# EAGLE design bar graph meter 2in clip in w 47uF (EAGLE 7.4.0)
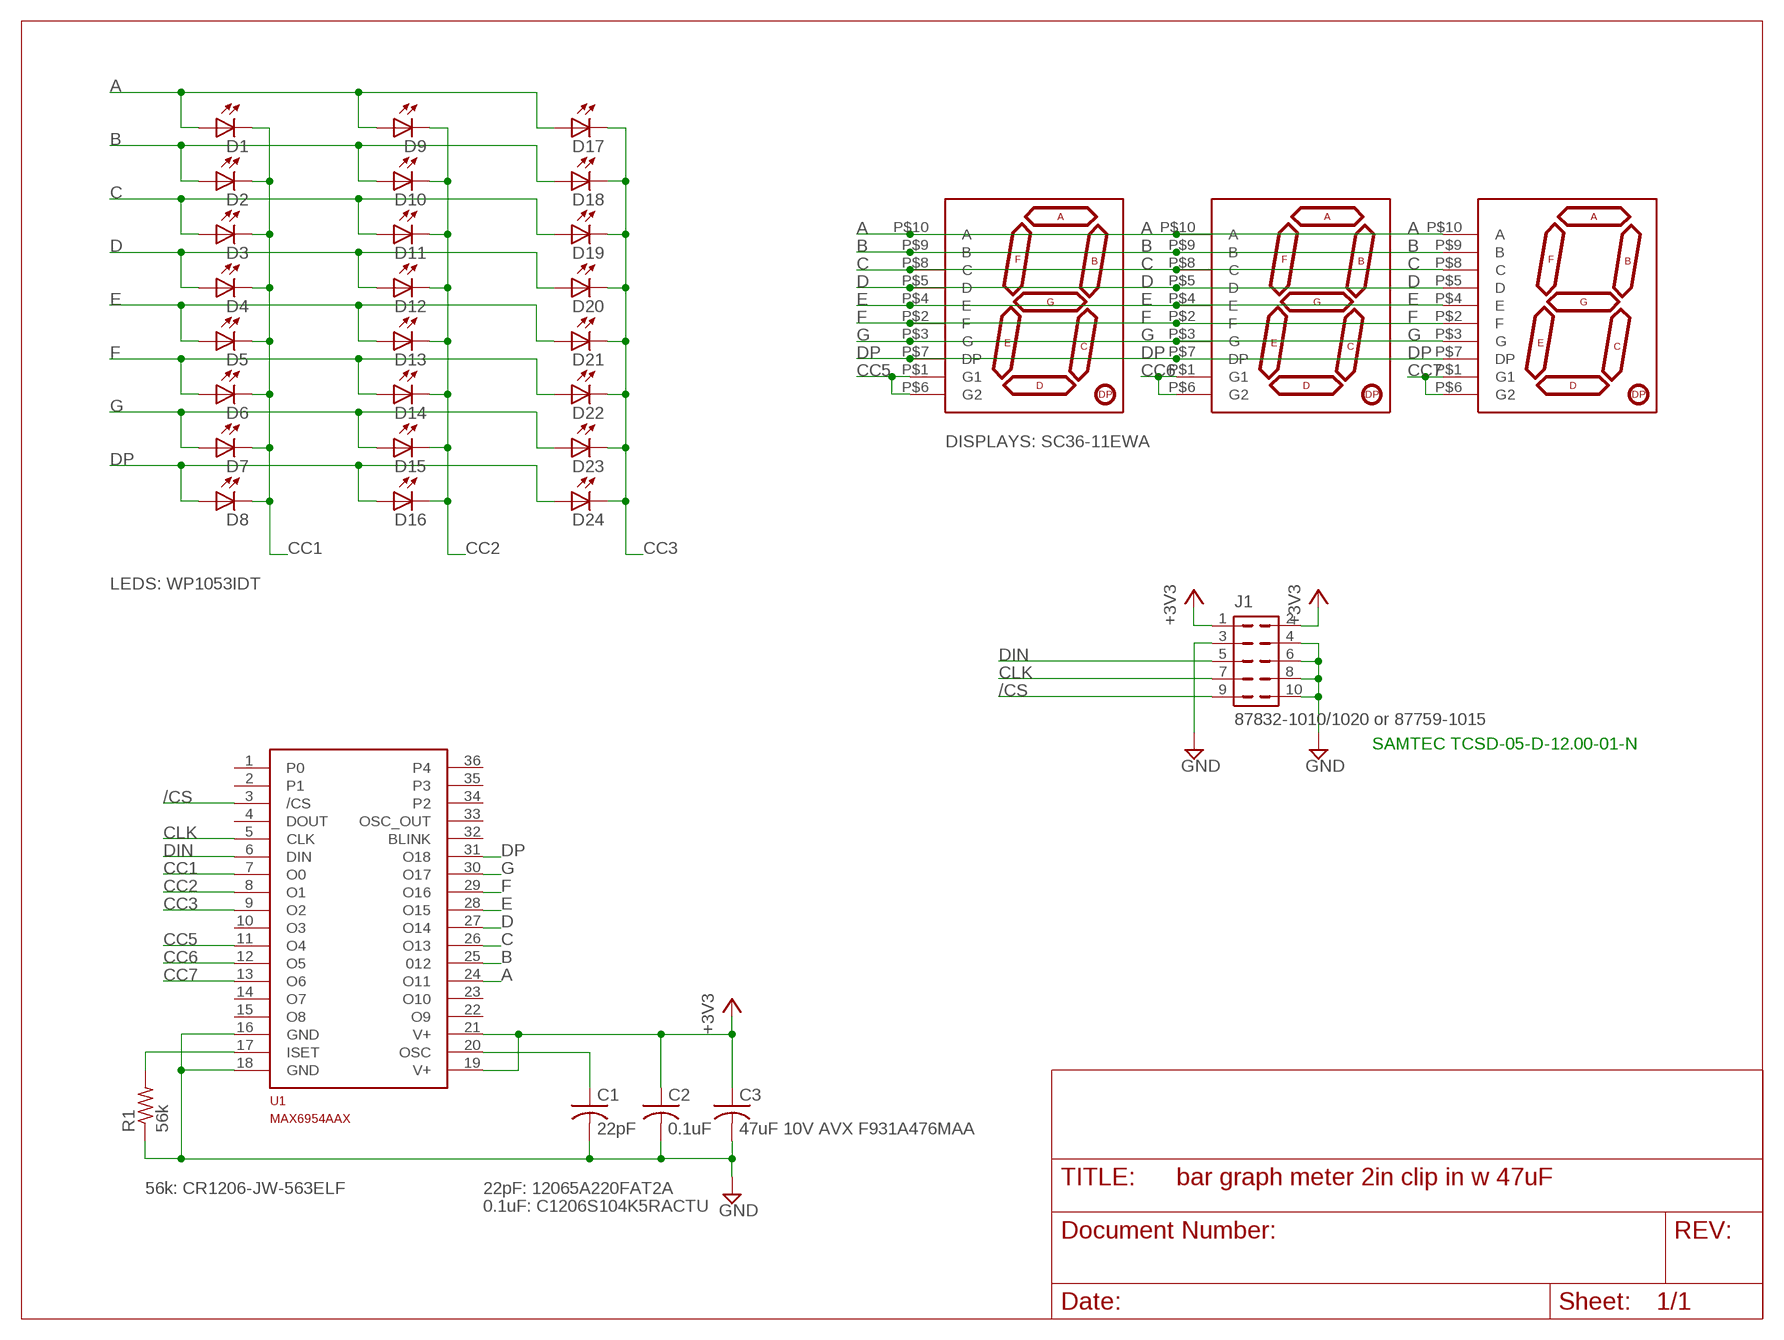
[diagram p0: schematic, sheet 1]

## Parts
C1  22pF  C-USC1206  [C1206]
C2  0.1uF  C-USC1206  [C1206]
C3  47uF 10V AVX F931A476MAA  C-USC1206  [C1206]
D1  LEDSQR2X5  [LED2X5]
D2  LEDSQR2X5  [LED2X5]
D3  LEDSQR2X5  [LED2X5]
D4  LEDSQR2X5  [LED2X5]
D5  LEDSQR2X5  [LED2X5]
D6  LEDSQR2X5  [LED2X5]
D7  LEDSQR2X5  [LED2X5]
D8  LEDSQR2X5  [LED2X5]
D9  LEDSQR2X5  [LED2X5]
D10  LEDSQR2X5  [LED2X5]
D11  LEDSQR2X5  [LED2X5]
D12  LEDSQR2X5  [LED2X5]
D13  LEDSQR2X5  [LED2X5]
D14  LEDSQR2X5  [LED2X5]
D15  LEDSQR2X5  [LED2X5]
D16  LEDSQR2X5  [LED2X5]
D17  LEDSQR2X5  [LED2X5]
D18  LEDSQR2X5  [LED2X5]
D19  LEDSQR2X5  [LED2X5]
D20  LEDSQR2X5  [LED2X5]
D21  LEDSQR2X5  [LED2X5]
D22  LEDSQR2X5  [LED2X5]
D23  LEDSQR2X5  [LED2X5]
D24  LEDSQR2X5  [LED2X5]
D25  SC36-11EWA  SA36-11EWA  [SA36-11]
D26  SC36-11EWA  SA36-11EWA  [SA36-11]
D27  SC36-11EWA  SA36-11EWA  [SA36-11]
J1  87832-1010/1020 or 87759-1015  87832-10  [87832-10]
R1  56k  R-US_R1206  [R1206]
U1  MAX6954AAX  [MAXIM-0.8-SSOP36]

## Nets
+3V3: C2.1 C3.1 J1.1 J1.2 U1.19(V+) U1.21(V+)
/CS: J1.9 U1.3(/CS)
A: D1.A D9.A D17.A D25.P$10(A) D26.P$10(A) D27.P$10(A) U1.24(O11)
B: D2.A D10.A D18.A D25.P$9(B) D26.P$9(B) D27.P$9(B) U1.25
C: D3.A D11.A D19.A D25.P$8(C) D26.P$8(C) D27.P$8(C) U1.26(O13)
CC1: D1.K(C) D2.K(C) D3.K(C) D4.K(C) D5.K(C) D6.K(C) D7.K(C) D8.K(C) U1.7(O0)
CC2: D9.K(C) D10.K(C) D11.K(C) D12.K(C) D13.K(C) D14.K(C) D15.K(C) D16.K(C) U1.8(O1)
CC3: D17.K(C) D18.K(C) D19.K(C) D20.K(C) D21.K(C) D22.K(C) D23.K(C) D24.K(C) U1.9(O2)
CC5: D25.P$1(G1) D25.P$6(G2) U1.11(O4)
CC6: D26.P$1(G1) D26.P$6(G2) U1.12(O5)
CC7: D27.P$1(G1) D27.P$6(G2) U1.13(O6)
CLK: J1.7 U1.5(CLK)
CSET: C1.1 U1.20(OSC)
D: D4.A D12.A D20.A D25.P$5(D) D26.P$5(D) D27.P$5(D) U1.27(O14)
DIN: J1.5 U1.6(DIN)
DP: D8.A D16.A D24.A D25.P$7(DP) D26.P$7(DP) D27.P$7(DP) U1.31(O18)
E: D5.A D13.A D21.A D25.P$4(E) D26.P$4(E) D27.P$4(E) U1.28(O15)
F: D6.A D14.A D22.A D25.P$2(F) D26.P$2(F) D27.P$2(F) U1.29(O16)
G: D7.A D15.A D23.A D25.P$3(G) D26.P$3(G) D27.P$3(G) U1.30(O17)
GND: C1.2 C2.2 C3.2 J1.3 J1.4 J1.6 J1.8 J1.10 R1.1 U1.16(GND) U1.18(GND)
ISET: R1.2 U1.17(ISET)
Unconnected: U1.1(P0) U1.2(P1) U1.4(DOUT) U1.10(O3) U1.14(O7) U1.15(O8) U1.22(O9) U1.23(O10) U1.32(BLINK) U1.33(OSC_OUT) U1.34(P2) U1.35(P3) U1.36(P4)

## Notes on the sheet
- DISPLAYS: SC36-11EWA
- LEDS: WP1053IDT
- SAMTEC TCSD-05-D-12.00-01-N
- 56k: CR1206-JW-563ELF | 22pF: 12065A220FAT2A
- 0.1uF: C1206S104K5RACTU

## Library data of the parts
C1-C3 = rcl:C-US: CAPACITOR, American symbol
D1-D24 = led:LED: LED OSRAM: - CHIPLED LG R971, LG N971, LY N971, LG Q971, LY Q971, LO R971, LY R971 LH N974, LH R974 LS Q976, LO Q976, LY Q976 LO Q996 - Hyper CHIPLED LW Q18S LB Q993, LB Q99A, LB R99A - SideLED LS A670, LO A670, LY A670, LG A670, LP A670 LB A673, LV A673, LT A673, LW A673 LH A674 LY A675 LS A676, LA A676, LO A676, LY A676, LW A676 LS A679, LY A679, LG A679 - Hyper Micro SIDELED® LS Y876, LA Y876, LO Y876, LY Y876 LT Y87S - SmartLED LW L88C, LW L88S LB L89C, LB L89S, LG L890 LS L89K, LO L89K, LY L89K LS L896, LA L896, LO L896, LY L896 - TOPLED LS T670, LO T670, LY T670, LG T670, LP T670 LSG T670, LSP T670, LSY T670, LOP T670, LYG T670 LG T671, LOG T671, LSG T671 LB T673, LV T673, LT T673, LW T673 LH T674 LS T676, LA T676, LO T676, LY T676, LB T676, LH T676, LSB T676, LW T676 LB T67C, LV T67C, LT T67C, LS T67K, LO T67K, LY T67K, LW E67C LS E67B, LA E67B, LO E67B, LY E67B, LB E67C, LV E67C, LT E67C LW T67C LS T679, LY T679, LG T679 LS T770, LO T770, LY T770, LG T770, LP T770 LB T773, LV T773, LT T773, LW T773 LH T774 LS E675, LA E675, LY E675, LS T675 LS T776, LA T776, LO T776, LY T776, LB T776 LHGB T686 LT T68C, LB T68C - Hyper Mini TOPLED® LB M676 - Mini TOPLED Santana® LG M470 LS M47K, LO M47K, LY M47K Source: http://www.osram.convergy.de LUXEON: - LUMILED® LXK2-PW12-R00, LXK2-PW12-S00, LXK2-PW14-U00, LXK2-PW14-V00 LXK2-PM12-R00, LXK2-PM12-S00, LXK2-PM14-U00 LXK2-PE12-Q00, LXK2-PE12-R00, LXK2-PE12-S00, LXK2-PE14-T00, LXK2-PE14-U00 LXK2-PB12-K00, LXK2-PB12-L00, LXK2-PB12-M00, LXK2-PB14-N00, LXK2-PB14-P00, LXK2-PB14-Q00 LXK2-PR12-L00, LXK2-PR12-M00, LXK2-PR14-Q00, LXK2-PR14-R00 LXK2-PD12-Q00, LXK2-PD12-R00, LXK2-PD12-S00 LXK2-PH12-R00, LXK2-PH12-S00 LXK2-PL12-P00, LXK2-PL12-Q00, LXK2-PL12-R00 Source: www.luxeon.com KINGBRIGHT: KA-3528ASYC Source: www.kingbright.com
D25-D27 = GlenPartsLibrary:SA36-11EWA
J1 = con-molex:87832-10: Milli-Grid Header 2.00mm (.079") Pitch; OC_FARNELL: unknown; OC_NEWARK: unknown
R1 = rcl:R-US_: RESISTOR, American symbol
U1 = GlenPartsLibrary:MAX6954AAX

## Board
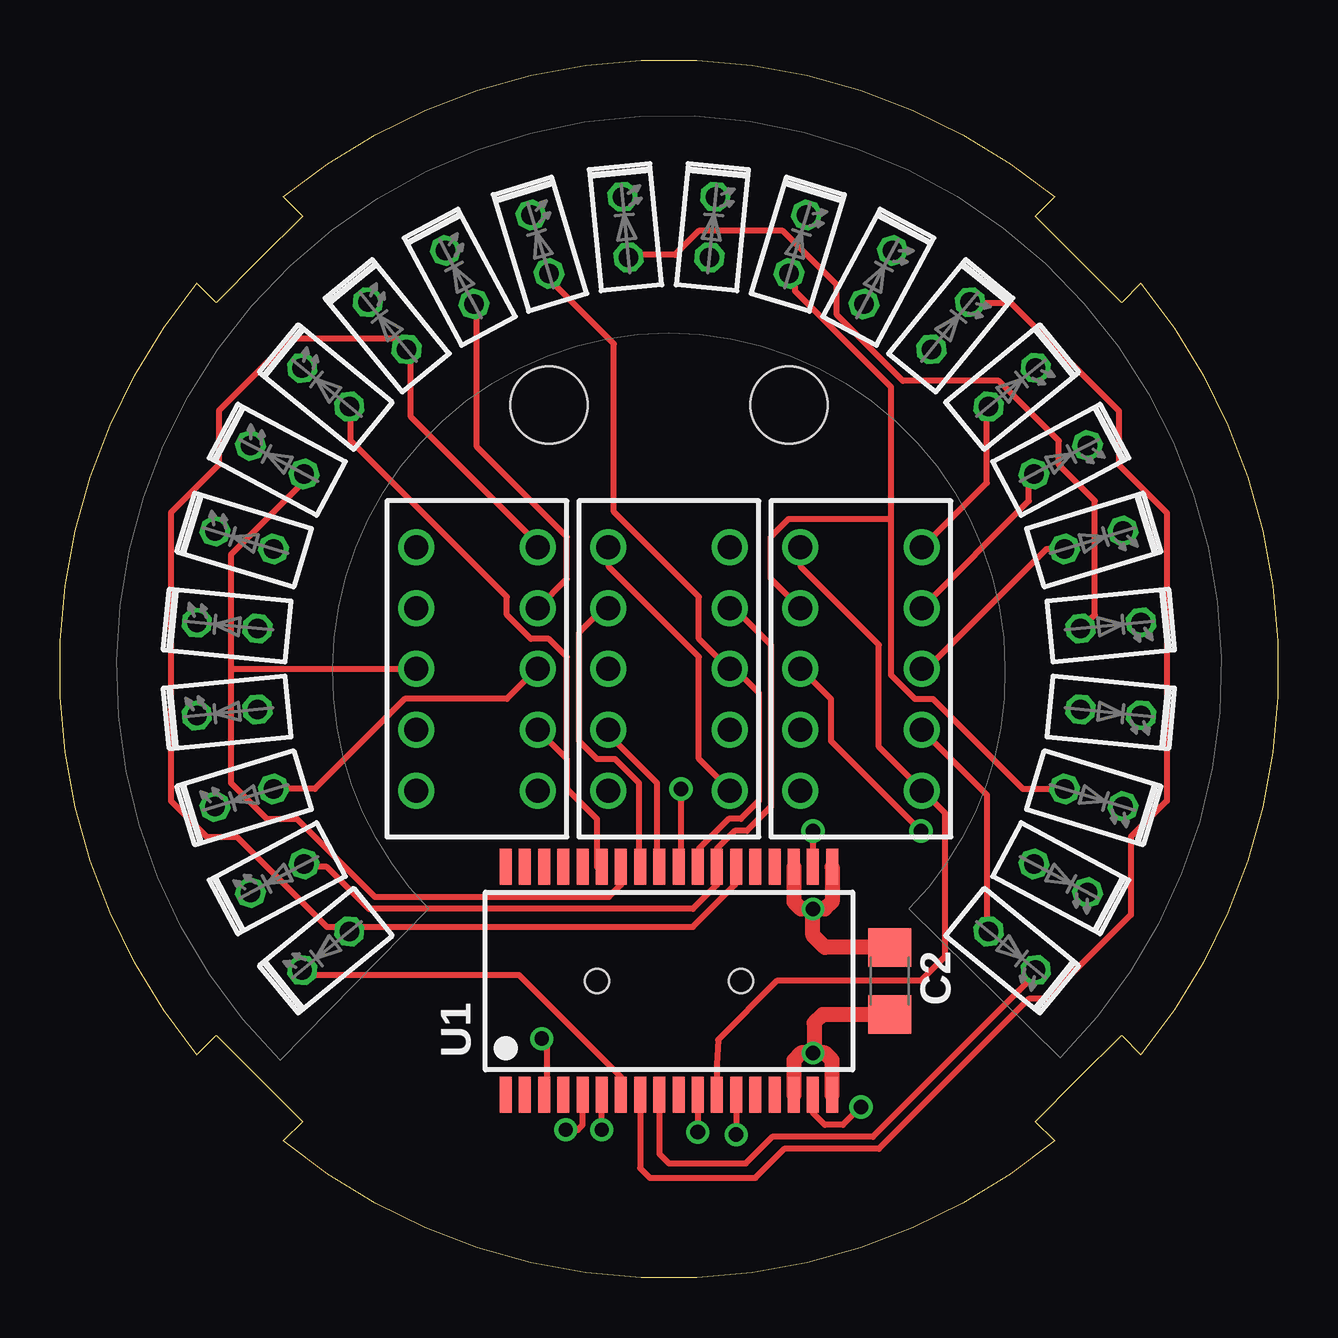
[diagram p1: board, top side]
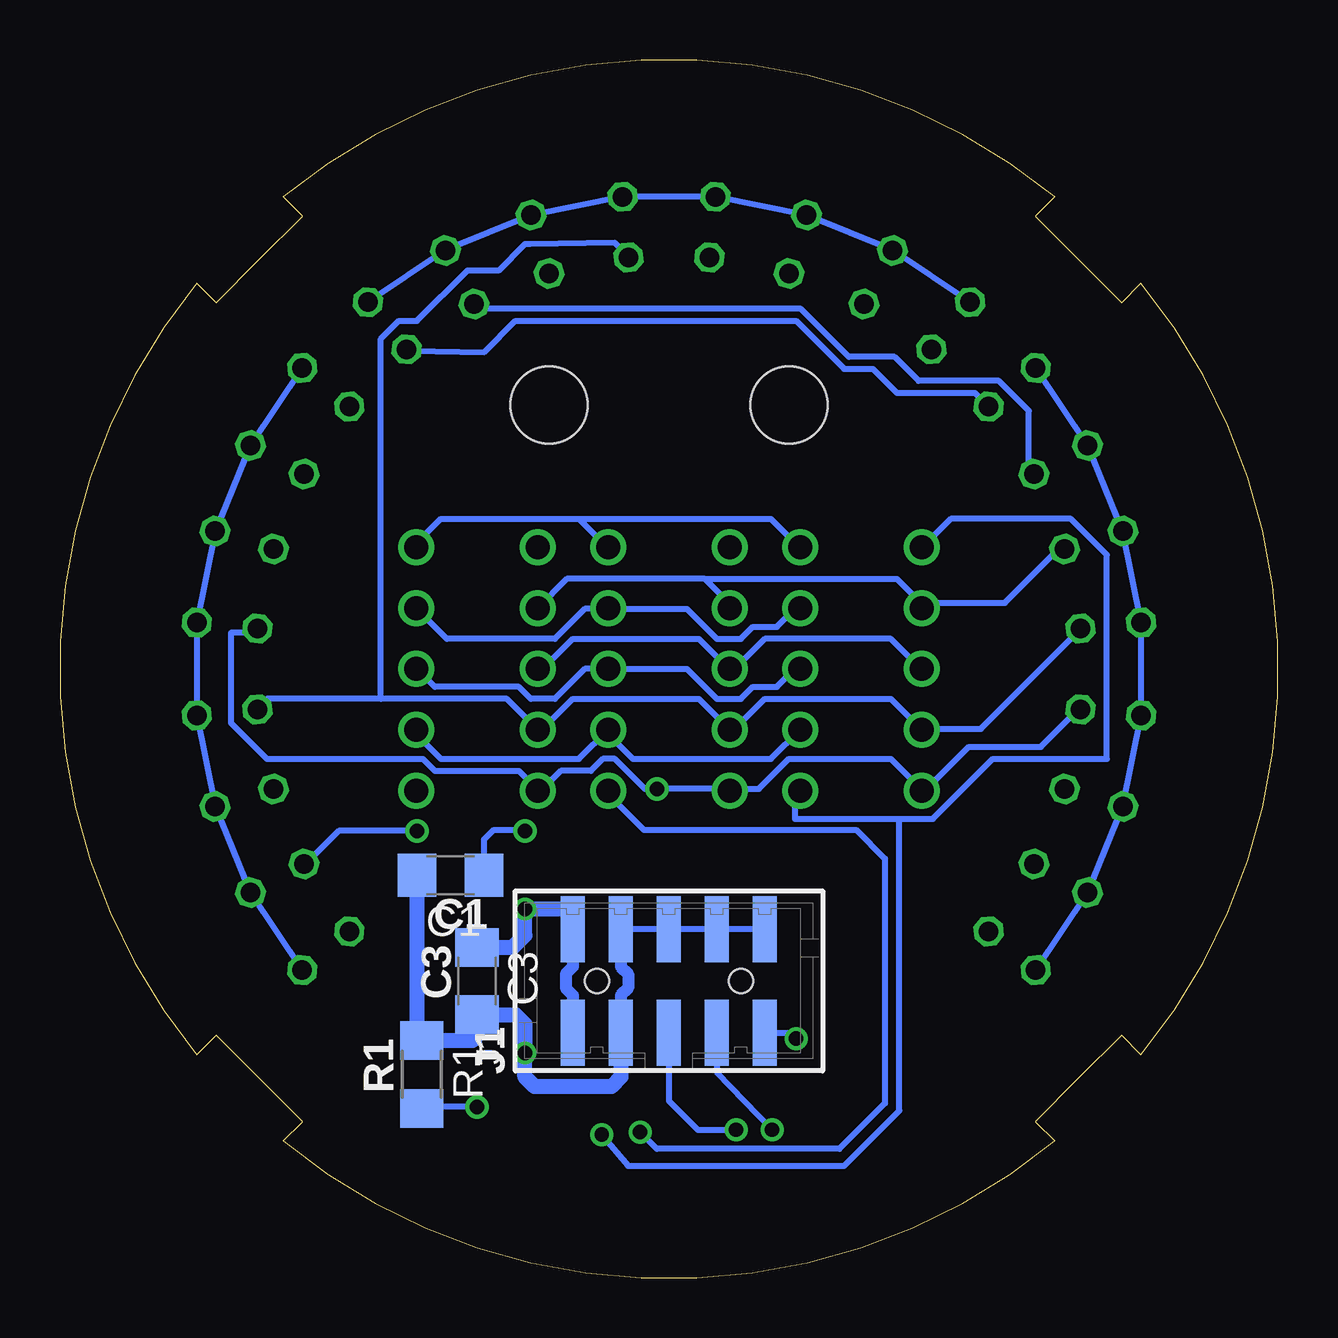
[diagram p2: board, bottom side, seen from below]

Size 50.75 x 50.75 mm. Coordinates in mm from the lower left corner, seen from the top.
Outline: 5.71,9.3 arc-79 5.71,41.45 6.51,40.64 8.31,42.44 10.11,44.23 9.3,45.04 arc-79 41.45,45.04 40.64,44.23 42.44,42.44 44.23,40.64 45.04,41.45 arc-79 45.04,9.3 44.23,10.11 42.44,8.31 40.64,6.51 41.45,5.71 arc-79 9.3,5.71 10.11,6.51 8.31,8.31 6.51,10.11 5.71,9.3
Copper layers (1*16): Top 0.0356mm / dielectric 1.5011mm / Bottom 0.0356mm
Design rules "LaenPCBOrder": minimum track width 6mil, minimum drill 13mil, track to track 6mil, track to pad 6mil, pad to pad 6mil, via to via 6mil, smd to smd 6mil, copper to edge 15mil, drill to drill 6mil, minimum pad ring 7mil, minimum via ring 7mil, stop-mask expansion 4mil, vias tented up to drill 0mil, thermal gap 10mil
Holes 3.2 mm at 30.37,36.37 20.37,36.37
tKeepout: area 6.5,38.8 to 11.9,44.2; area 6.5,6.5 to 11.9,11.9; area 38.8,38.8 to 44.2,44.2; area 38.8,6.5 to 44.2,11.9
bKeepout: area 6.5,38.8 to 11.9,44.2; area 38.8,38.8 to 44.2,44.2; area 38.8,6.5 to 44.2,11.9; area 6.5,6.5 to 11.9,11.9

### Footprints (pad centres in the part's own frame; a part is rotated, then mirrored left to right if it is on the bottom)
C1206 = smd 1.6 x 1.8: 1 -1.4,0; 2 1.4,0
LED2X5 = drill 0.813 octagon: A -1.27,0; K 1.27,0
SA36-11 = drill 1: P$1 -2.54,5.08; P$2 -2.54,2.54; P$3 -2.54,0; P$4 -2.54,-2.54; P$5 -2.54,-5.08; P$6 2.54,-5.08; P$7 2.54,-2.54; P$8 2.54,0; P$9 2.54,2.54; P$10 2.54,5.08
87832-10 = smd 1 x 2.75: 1 -4,-2.15; 2 -4,2.15; 3 -2,-2.15; 4 -2,2.15; 5 0,-2.15; 6 0,2.15; 7 2,-2.15; 8 2,2.15; 9 4,-2.15; 10 4,2.15 | hole 1: -3,0; 3,0
R1206 = smd 1.6 x 1.803: 1 -1.422,0; 2 1.422,0
MAXIM-0.8-SSOP36 = smd 0.5 x 1.5: 1 -6.8,-4.75; 2 -6,-4.75; 3 -5.2,-4.75; 4 -4.4,-4.75; 5 -3.6,-4.75; 6 -2.8,-4.75; 7 -2,-4.75; 8 -1.2,-4.75; 9 -0.4,-4.75; 10 0.4,-4.75; 11 1.2,-4.75; 12 2,-4.75; 13 2.8,-4.75; 14 3.6,-4.75; 15 4.4,-4.75; 16 5.2,-4.75; 17 6,-4.75; 18 6.8,-4.75; 19 6.8,4.75; 20 6,4.75; 21 5.2,4.75; 22 4.4,4.75; 23 3.6,4.75; 24 2.8,4.75; 25 2,4.75; 26 1.2,4.75; 27 0.4,4.75; 28 -0.4,4.75; 29 -1.2,4.75; 30 -2,4.75; 31 -2.8,4.75; 32 -3.6,4.75; 33 -4.4,4.75; 34 -5.2,4.75; 35 -6,4.75; 36 -6.8,4.75

### Placement (x,y rotation side)
C1  34.47,16.77 180 bottom
C2  34.57,12.37 270 top
C3  33.37,12.37 270 bottom
D1  11.07,13.63 219.4 top
D2  9.05,16.65 208.1 top
D3  7.67,20 196.9 top
D4  6.96,23.56 185.6 top
D5  6.96,27.18 174.4 top
D6  7.67,30.74 163.1 top
D7  9.05,34.09 151.9 top
D8  11.07,37.11 140.6 top
D9  13.63,39.67 129.4 top
D10  16.65,41.69 118.1 top
D11  20,43.07 106.9 top
D12  23.56,43.78 95.6 top
D13  27.18,43.78 84.4 top
D14  30.74,43.07 73.1 top
D15  34.09,41.69 61.9 top
D16  37.11,39.67 50.6 top
D17  39.67,37.11 39.4 top
D18  41.69,34.09 28.1 top
D19  43.07,30.74 16.9 top
D20  43.78,27.18 5.6 top
D21  43.78,23.56 354.4 top
D22  43.07,20 343.1 top
D23  41.69,16.65 331.9 top
D24  39.67,13.63 320.6 top
D25  25.37,25.37 0 top
D26  33.37,25.37 0 top
D27  17.37,25.37 0 top
J1  25.37,12.37 0 bottom
R1  35.67,8.47 270 bottom
U1  25.37,12.37 0 top

### Tracks (layer width: path | path; a pad name or v marks a point on that pad's centre or on a via)
+3V3  (via drill 0.6)
  Top 0.635: U1.19 32.17,15.67 31.87,15.37 v31.37,15.37 | U1.21 30.57,15.67 30.87,15.37 v31.37,15.37 | C2.1 31.87,13.77 31.37,14.27 v31.37,15.37
  Bottom 0.508: J1.2 29.37,12.97 29.67,12.67 29.67,12.07 29.37,11.77 J1.1
  Bottom 0.635: 29.47,14.47 J1.2 29.37,15.27 29.47,15.37 v31.37,15.37 31.37,14.27 31.87,13.77 C3.1
/CS  (via drill 0.6)
  Top 0.254: v20.07,9.97 20.27,9.77 20.27,7.72 U1.3
  Bottom 0.254: J1.9 20.32,10.22 v20.07,9.97
A
  Top 0.254: U1.24 28.12,17.12 28.12,16.37 26.37,14.62 12.12,14.62 D1.A 11.87,14.62 11.12,14.62 7.37,18.37 6.12,18.37 4.62,19.87 4.62,31.87 6.62,33.87 6.62,36.12 9.62,39.12 14.12,39.12 14.37,38.87 D9.A 14.62,38.62 14.62,35.87 19.87,30.62 D27.P$10 | D17.A 38.62,36.12 38.62,33.12 36.12,30.62 D26.P$10
  Bottom 0.254: 29.12,31.62 28.12,30.62 D25.P$10 | 29.12,31.62 34.87,31.62 35.87,30.62 D26.P$10 | 29.12,31.62 21.12,31.62 20.12,30.62 D27.P$10
B
  Top 0.254: D27.P$9 21.12,29.12 21.12,30.87 17.37,34.62 17.37,40.37 D10.A | D26.P$9 40.37,32.37 40.37,33.37 D18.A | D25.P$9 28.12,27.87 29.62,26.37 29.62,19.62 28.62,18.62 28.12,18.62 27.37,17.87 U1.25 27.37,16.37 26.37,15.37 12.87,15.37 11.12,17.12 10.37,17.12 D2.A
  Bottom 0.254: D26.P$9 34.62,26.62 30.12,26.62 28.87,27.87 28.12,27.87 D25.P$9 27.87,27.87 24.62,27.87 23.37,26.62 22.37,26.62 21.87,27.12 20.87,27.12 20.12,27.87 D27.P$9
C
  Top 0.254: D3.A 9.12,20.37 10.62,20.37 14.37,24.12 18.62,24.12 19.87,25.37 D27.P$8 | D19.A 41.62,30.37 41.12,30.37 36.12,25.37 D26.P$8 | U1.26 26.62,17.12 26.62,17.87 27.87,19.12 28.37,19.12 29.12,19.87 29.12,24.37 28.12,25.37 D25.P$8 27.87,25.37 26.62,26.62 26.62,28.37 23.07,31.92 23.07,38.92 20.37,41.62 D11.A
  Bottom 0.254: D26.P$8 35.87,25.37 35.12,24.62 31.62,24.62 31.12,24.12 30.12,24.12 28.87,25.37 D25.P$8 24.62,25.37 23.37,24.12 22.37,24.12 21.87,24.62 20.87,24.62 20.12,25.37 D27.P$8
CC1
  Top 0.254: D1.K 10.12,12.62 19.12,12.62 23.37,8.37 U1.7
  Bottom 0.254: D1.K D2.K D3.K D4.K D5.K D6.K D7.K D8.K
CC2
  Top 0.254: D16.K 38.12,40.62 39.62,40.62 44.12,36.12 44.12,33.87 46.12,31.87 46.12,19.87 44.62,18.37 44.62,15.12 41.12,11.62 40.37,11.62 34.12,5.37 30.17,5.37 28.97,4.17 24.57,4.17 24.17,4.57 U1.8
  Bottom 0.254: D9.K D10.K D11.K D12.K D13.K D14.K D15.K D16.K
CC3
  Top 0.254: D24.K 40.62,12.62 33.87,5.87 29.67,5.87 28.57,4.77 25.37,4.77 24.97,5.17 U1.9
  Bottom 0.254: D17.K D18.K D19.K D20.K D21.K D22.K D23.K D24.K
CC5  (via drill 0.61)
  Top 0.254: D25.P$1 22.87,30.37 22.87,29.62 26.62,25.87 26.62,21.62 27.87,20.37 D25.P$6 | U1.11 v26.57,6.07
  Bottom 0.254: v26.57,6.07 25.87,5.37 18.27,5.37 16.37,7.27 16.37,17.47 17.57,18.67 26.42,18.67 27.87,20.12 D25.P$6
CC6
  Top 0.254: U1.12 27.37,8.87 27.42,9.92 29.87,12.37 35.87,12.37 36.87,13.37 36.87,19.37 36.12,20.12 D26.P$6 35.87,20.37 34.12,22.12 34.12,26.37 30.87,29.62 30.87,30.37 D26.P$1
CC7  (via drill 0.6)
  Top 0.254: U1.13 v28.17,5.97
  Bottom 0.254: D27.P$6 20.12,20.12 20.12,19.12 15.77,19.12 | 15.77,19.12 14.37,19.12 11.87,21.62 7.12,21.62 7.12,30.12 8.62,31.62 13.62,31.62 14.62,30.62 D27.P$1 | v28.17,5.97 27.07,4.67 18.07,4.67 15.77,6.97 15.77,19.12
CLK  (via drill 0.6)
  Top 0.254: v21.07,6.17 21.57,6.17 21.77,6.37 U1.5
  Bottom 0.254: J1.7 23.37,8.57 v21.07,6.17
CSET  (via drill 0.61)
  Top 0.254: v31.37,18.62 U1.20
  Bottom 0.254: C1.1 33.07,18.27 32.67,18.67 31.42,18.67 v31.37,18.62
D  (via drill 0.61)
  Top 0.254: v25.87,20.37 25.87,17.12 U1.27 | D12.A 23.87,42.62 25.62,42.62 26.62,43.62 30.12,43.62 32.37,41.37 32.37,40.12 35.12,37.37 39.12,37.37 41.62,34.87 41.62,33.87 43.12,32.37 43.12,27.62 42.62,27.12 D20.A
  Bottom 0.254: D4.A 8.37,23.62 9.87,22.12 12.87,22.12 14.62,20.37 D27.P$5 14.87,20.37 16.12,21.62 20.37,21.62 21.62,20.37 22.62,20.37 D25.P$5 22.87,20.37 v25.87,20.37 26.37,20.37 27.62,21.62 28.12,21.62 28.62,21.12 29.87,21.12 30.62,20.37 D26.P$5 30.87,20.37 31.62,21.12 35.12,21.12 35.62,21.62 42.12,21.62 43.62,23.12 43.62,26.87 42.62,26.87 D20.A
DIN  (via drill 0.6)
  Top 0.254: v22.57,6.17 U1.6
  Bottom 0.254: J1.5 25.37,7.37 24.17,6.17 v22.57,6.17
DP
  Top 0.254: 21.12,21.62 21.12,20.37 22.37,19.12 22.37,17.12 U1.31 | D27.P$7 21.12,21.62 | D26.P$7 38.62,20.12 38.62,14.62 D24.A | 21.12,21.62 21.12,25.87 20.37,26.62 19.62,26.62 18.62,27.62 18.62,28.37 12.12,34.87 12.12,36.12 D8.A
  Bottom 0.254: D8.A 12.12,36.37 12.62,36.87 15.87,36.87 16.87,37.87 18.07,37.87 20.07,39.87 31.77,39.87 33.07,38.57 36.12,38.62 D16.A | D26.P$7 35.87,22.62 34.87,21.62 29.12,21.62 D25.P$7 27.87,22.62 26.87,21.62 21.12,21.62 D27.P$7
E
  Top 0.254: U1.28 24.87,17.12 24.87,20.62 22.87,22.62 D25.P$4
  Bottom 0.254: D5.A 8.37,26.87 12.37,22.87 14.62,22.87 D27.P$4 16.12,24.12 21.37,24.12 22.62,22.87 D25.P$4 24.12,24.12 29.37,24.12 30.62,22.87 D26.P$4 32.12,24.12 37.37,24.12 | 37.37,24.12 42.12,24.12 42.37,23.87 D21.A | 37.37,24.12 37.37,39.12 36.62,39.87 35.87,39.87 33.77,41.97 32.47,41.97 31.37,43.07 31.17,43.07 27.62,43.12 27.12,42.62 D13.A
F
  Top 0.254: 34.62,31.62 34.62,37.12 30.62,41.12 30.62,41.62 D14.A | 34.62,31.62 34.62,25.12 35.62,24.12 36.37,24.12 40.12,20.37 41.62,20.37 D22.A | U1.29 24.12,17.12 24.12,20.62 23.12,21.62 22.37,21.62 21.62,22.37 21.62,26.87 22.62,27.87 D25.P$2 | 34.62,31.62 30.37,31.62 29.62,30.87 29.62,29.12 D26.P$2
  Bottom 0.254: D6.A 9.12,30.37 11.37,28.12 14.62,28.12 D27.P$2 14.87,28.12 15.87,29.12 23.87,29.12 | D26.P$2 29.62,29.12 23.87,29.12 | 23.87,29.12 22.87,28.12 D25.P$2
G  (via drill 0.61)
  Top 0.254: v35.87,18.62 32.12,22.37 32.12,24.12 30.87,25.37 D26.P$3 | U1.30 23.37,16.37 22.87,15.87 13.12,15.87 9.87,19.12 8.62,19.12 7.12,20.62 7.12,25.37 | 7.12,25.37 7.12,30.12 10.37,33.37 D7.A | 7.12,25.37 D27.P$3
  Bottom 0.254: v35.87,18.62 39.12,18.62 40.37,17.37 D23.A | D26.P$3 30.62,25.37 29.37,26.62 24.12,26.62 22.87,25.37 D25.P$3 22.62,25.37 21.37,26.62 16.12,26.62 14.87,25.37 D27.P$3 | D15.A 33.37,40.37 19.87,40.37 17.87,38.37 15.97,38.37 14.97,37.37 11.62,37.37 10.37,36.12 10.37,33.62 D7.A
GND  (via drill 0.6)
  Top 0.635: U1.18 32.17,9.07 31.87,9.37 v31.37,9.37 | v31.37,9.37 30.87,9.37 30.57,9.07 U1.16 | C2.2 31.77,10.97 31.42,10.62 31.42,9.42 v31.37,9.37
  Bottom 0.254: J1.10 J1.8 J1.6 J1.4
  Bottom 0.508: J1.4 27.37,12.97 27.07,12.67 27.07,12.07 27.37,11.77 J1.3
  Bottom 0.635: J1.3 27.37,8.37 27.77,7.97 30.97,7.97 31.37,8.37 v31.37,9.37 31.37,10.57 31.77,10.97 C3.2 33.37,10.07 33.55,9.9 R1.1 35.87,10.1 C1.2
ISET  (via drill 0.61)
  Top 0.254: U1.17 31.37,6.87 31.87,6.37 32.62,6.37 v33.37,7.12
  Bottom 0.254: v33.37,7.12 35.6,7.12 R1.2

### Text on the board
_tsilk: C2 | U1
_bsilk: C1 | C3 | J1 | R1